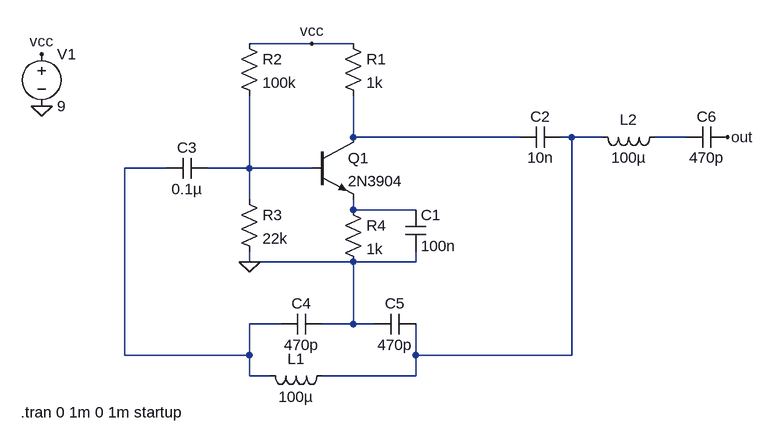
[diagram p0: schematic colpitts.asc]
colpitts.asc, the LTspice schematic file:
Version 4
SHEET 1 888 680
WIRE 192 -48 96 -48
WIRE 256 -48 192 -48
WIRE 256 96 256 32
WIRE 512 96 256 96
WIRE 592 96 576 96
WIRE 640 96 592 96
WIRE 768 96 720 96
WIRE -32 144 -96 144
WIRE 96 144 96 32
WIRE 96 144 32 144
WIRE 192 144 96 144
WIRE 96 192 96 144
WIRE 256 208 256 192
WIRE 352 208 256 208
WIRE 96 288 96 272
WIRE 256 288 96 288
WIRE 352 288 352 272
WIRE 352 288 256 288
WIRE 144 384 96 384
WIRE 256 384 256 288
WIRE 256 384 208 384
WIRE 288 384 256 384
WIRE -96 432 -96 144
WIRE 96 432 96 384
WIRE 96 432 -96 432
WIRE 352 432 352 384
WIRE 592 432 592 96
WIRE 592 432 352 432
WIRE 96 464 96 432
WIRE 128 464 96 464
WIRE 352 464 352 432
WIRE 352 464 208 464
FLAG -224 48 0
FLAG 96 288 0
FLAG -224 -32 vcc
FLAG 192 -48 vcc
FLAG 832 96 out
SYMBOL npn 192 96 R0
SYMATTR InstName Q1
SYMATTR Value 2N3904
SYMBOL res 240 -64 R0
SYMATTR InstName R1
SYMATTR Value 1k
SYMBOL res 80 -64 R0
SYMATTR InstName R2
SYMATTR Value 100k
SYMBOL res 80 176 R0
SYMATTR InstName R3
SYMATTR Value 22k
SYMBOL res 240 192 R0
SYMATTR InstName R4
SYMATTR Value 1k
SYMBOL cap 336 208 R0
SYMATTR InstName C1
SYMATTR Value 100n
SYMBOL cap 576 80 R90
WINDOW 0 0 32 VBottom 2
WINDOW 3 32 32 VTop 2
SYMATTR InstName C2
SYMATTR Value 10n
SYMBOL cap 32 128 R90
WINDOW 0 0 32 VBottom 2
WINDOW 3 32 32 VTop 2
SYMATTR InstName C3
SYMATTR Value 0.1µ
SYMBOL cap 208 368 R90
WINDOW 0 0 32 VBottom 2
WINDOW 3 32 32 VTop 2
SYMATTR InstName C4
SYMATTR Value 470p
SYMBOL cap 352 368 R90
WINDOW 0 0 32 VBottom 2
WINDOW 3 32 32 VTop 2
SYMATTR InstName C5
SYMATTR Value 470p
SYMBOL ind 224 448 R90
WINDOW 0 5 56 VBottom 2
WINDOW 3 32 56 VTop 2
SYMATTR InstName L1
SYMATTR Value 100µ
SYMBOL voltage -224 -48 R0
WINDOW 123 0 0 Left 0
WINDOW 39 0 0 Left 0
SYMATTR InstName V1
SYMATTR Value 9
SYMBOL ind 736 80 R90
WINDOW 0 5 56 VBottom 2
WINDOW 3 32 56 VTop 2
SYMATTR InstName L2
SYMATTR Value 100µ
SYMBOL cap 832 80 R90
WINDOW 0 0 32 VBottom 2
WINDOW 3 32 32 VTop 2
SYMATTR InstName C6
SYMATTR Value 470p
TEXT -256 520 Left 2 !.tran 0 1m 0 1m startup

The netlist it stands for:
* colpitts.asc
Q1 N001 N005 N006 0 2N3904
R1 vcc N001 1k
R2 vcc N005 100k
R3 N005 0 22k
R4 N006 0 1k
C1 N006 0 100n
C2 N002 N001 10n
C3 N005 N004 0.1µ
C4 0 N004 470p
C5 N002 0 470p
L1 N002 N004 100µ
V1 vcc 0 9
L2 N003 N002 100µ
C6 out N003 470p
.model NPN NPN
.model PNP PNP
.lib standard.bjt
.tran 0 1m 0 1m startup
.backanno
.end